# Altium schematic sheet 02_ldo5v5.SchDoc
size A; SheetNumber: 10; SheetTotal: 18
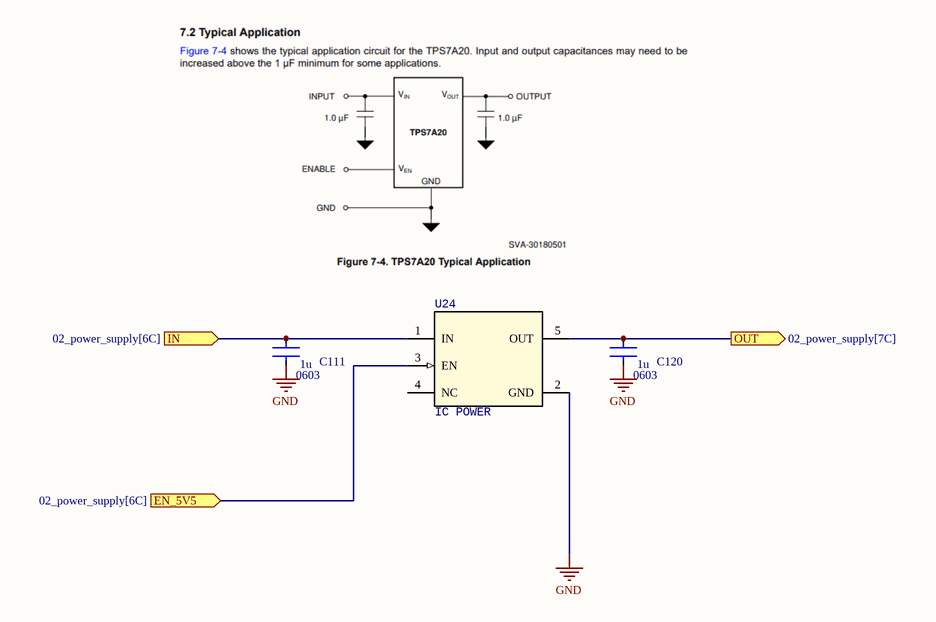
[diagram p0: 02_ldo5v5.SchDoc]

## Parts
C111  C1608X5R1E105K080AC  [CAPTDK0603]  (value not drawn)
C120  C1608X5R1E105K080AC  [CAPTDK0603]  (value not drawn)
U24  IC POWER  [SOT-23-5]

## Ports
EN_5V5 (in, see 02_power_supply[6C]), IN (in, see 02_power_supply[6C]), OUT (out, see 02_power_supply[7C])

## Nets
GND: C111.2 C120.2 U24.2(GND)
EN_5V5: U24.3(EN) ; port EN_5V5
IN: C111.1 U24.1(IN) ; port IN
OUT: C120.1 U24.5(OUT) ; port OUT

Not connected (* = marked no-connect by the designer): U24 4(NC)

## Notes on the sheet
- (in symbol C1608X5R1E105K080AC) 1u; 0603

## Library data of the parts
C111 C120 = C1608X5R1E105K080AC: CAP CER 1UF 25V X5R 0603; Supplier 1: Digi-Key; Supplier Part Number 1: 445-5146-1-ND
U24 = TPS7A2055PDBVR: Linear Voltage Regulator IC Positive Fixed 1 Output 300mA SOT-23-5 5v5; Supplier 1: Digikey; Supplier Part Number 1: 296-TPS7A2055PDBVRCT-ND